# EAGLE schematic blank (EAGLE 7.5.0)
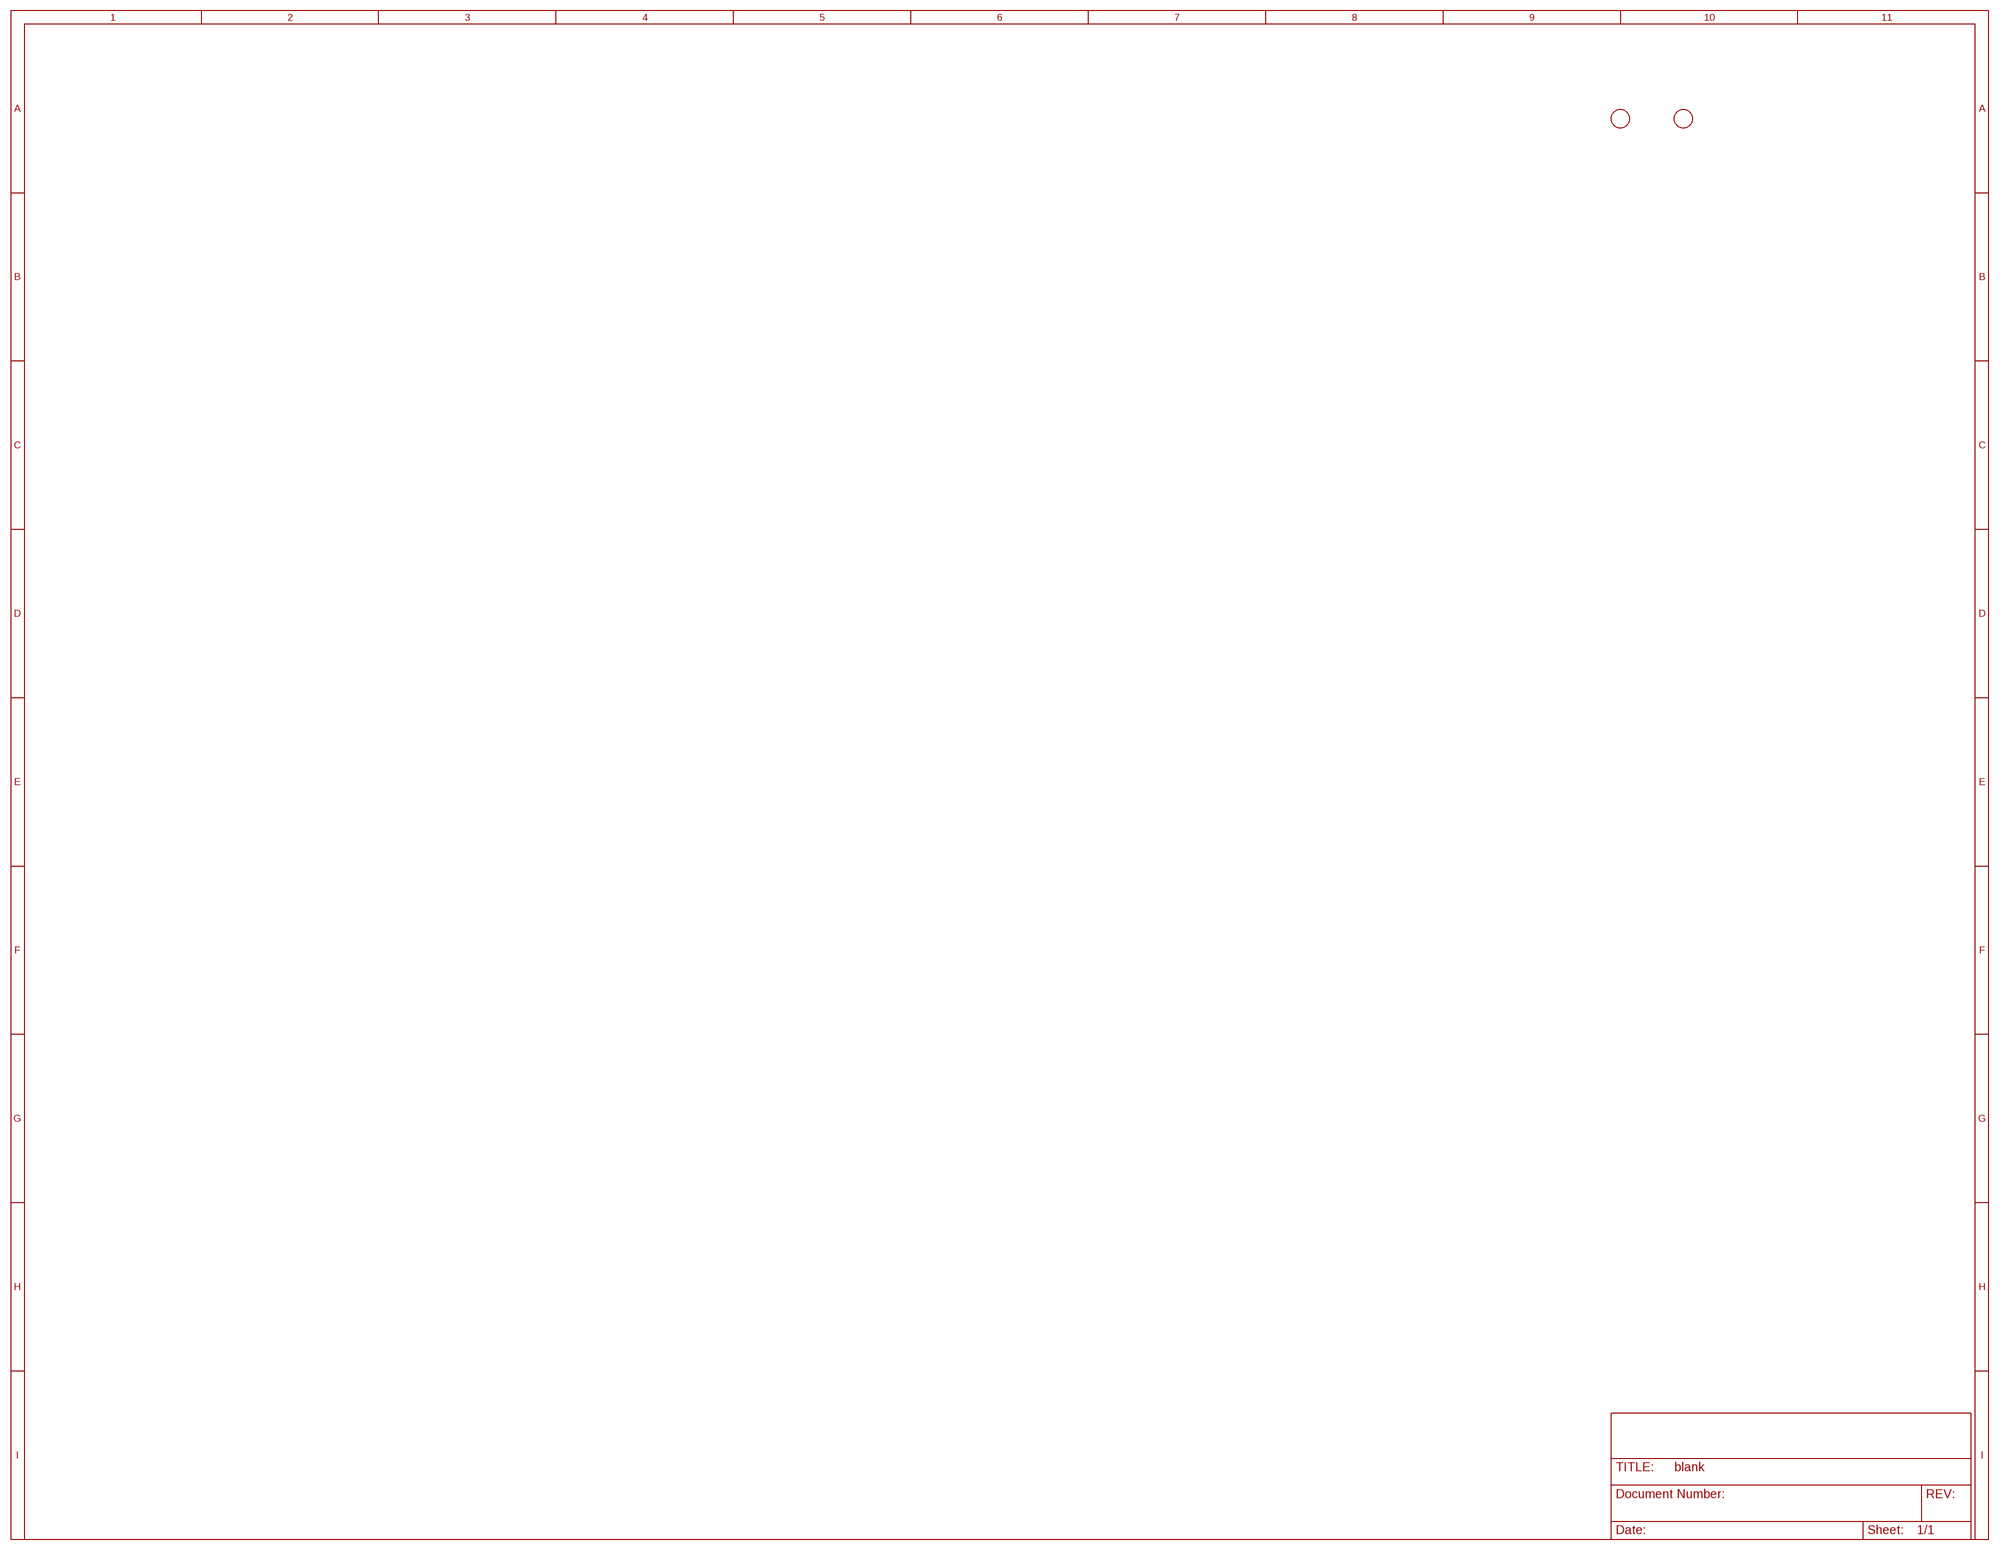
[diagram p0: schematic, sheet 1]

## Parts
U$1  FIDUCIAL  [FIDUCIAL_1MM]
U$2  FIDUCIAL  [FIDUCIAL_1MM]

## Library data of the parts
U$1 U$2 = adafruit:FIDUCIAL: For use by pick and place machines to calibrate the vision/machine, 1mm By microbuilder.eu